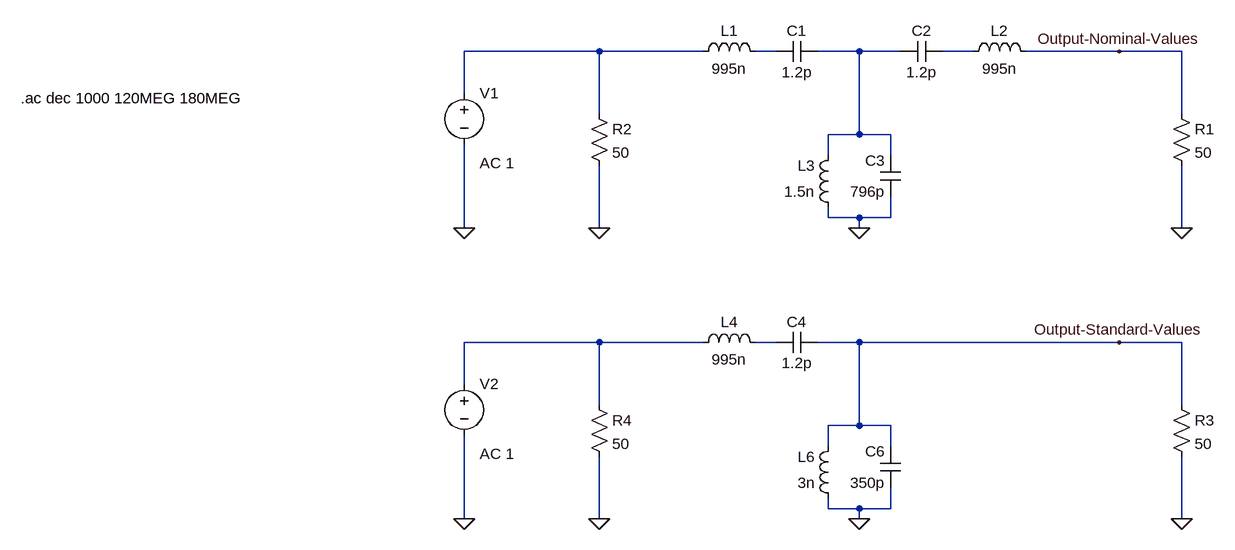
[diagram p0: schematic 2m_lc_bpf_revision_1.asc]
2m_lc_bpf_revision_1.asc, the LTspice schematic file:
Version 4
SHEET 1 880 820
WIRE -176 80 -384 80
WIRE -16 80 -176 80
WIRE 96 80 64 80
WIRE 224 80 160 80
WIRE 288 80 224 80
WIRE 400 80 352 80
WIRE 624 80 480 80
WIRE 720 80 624 80
WIRE -384 144 -384 80
WIRE -176 176 -176 80
WIRE 720 176 720 80
WIRE 224 208 224 80
WIRE 224 208 176 208
WIRE 272 208 224 208
WIRE 176 240 176 208
WIRE 272 240 272 208
WIRE 176 336 176 320
WIRE 224 336 176 336
WIRE 272 336 272 304
WIRE 272 336 224 336
WIRE -384 352 -384 224
WIRE -176 352 -176 256
WIRE 224 352 224 336
WIRE 720 352 720 256
WIRE -176 528 -384 528
WIRE -16 528 -176 528
WIRE 96 528 64 528
WIRE 224 528 160 528
WIRE 624 528 224 528
WIRE 720 528 624 528
WIRE -384 592 -384 528
WIRE -176 624 -176 528
WIRE 720 624 720 528
WIRE 224 656 224 528
WIRE 224 656 176 656
WIRE 272 656 224 656
WIRE 176 688 176 656
WIRE 272 688 272 656
WIRE 176 784 176 768
WIRE 224 784 176 784
WIRE 272 784 272 752
WIRE 272 784 224 784
WIRE -384 800 -384 672
WIRE -176 800 -176 704
WIRE 224 800 224 784
WIRE 720 800 720 704
FLAG 224 352 0
FLAG -384 352 0
FLAG 720 352 0
FLAG -176 352 0
FLAG 624 80 Output-Nominal-Values
FLAG -384 800 0
FLAG 224 800 0
FLAG 720 800 0
FLAG -176 800 0
FLAG 624 528 Output-Standard-Values
SYMBOL ind -32 96 R270
WINDOW 0 32 56 VTop 2
WINDOW 3 5 56 VBottom 2
SYMATTR InstName L1
SYMATTR Value 995n
SYMATTR SpiceLine Rser=10m
SYMBOL ind 384 96 R270
WINDOW 0 32 56 VTop 2
WINDOW 3 5 56 VBottom 2
SYMATTR InstName L2
SYMATTR Value 995n
SYMATTR SpiceLine Rser=10m
SYMBOL ind 192 336 R180
WINDOW 0 36 80 Left 2
WINDOW 3 36 40 Left 2
SYMATTR InstName L3
SYMATTR Value 1.5n
SYMATTR SpiceLine Rser=10m
SYMBOL cap 160 64 R90
WINDOW 0 0 32 VBottom 2
WINDOW 3 32 32 VTop 2
SYMATTR InstName C1
SYMATTR Value 1.2p
SYMATTR SpiceLine Rser=10m
SYMBOL cap 352 64 R90
WINDOW 0 0 32 VBottom 2
WINDOW 3 32 32 VTop 2
SYMATTR InstName C2
SYMATTR Value 1.2p
SYMATTR SpiceLine Rser=10m
SYMBOL cap 288 304 R180
WINDOW 0 24 56 Left 2
WINDOW 3 24 8 Left 2
SYMATTR InstName C3
SYMATTR Value 796p
SYMATTR SpiceLine Rser=10m
SYMBOL voltage -384 128 R0
WINDOW 123 24 124 Left 2
WINDOW 39 24 152 Left 2
SYMATTR InstName V1
SYMATTR Value ""
SYMATTR Value2 AC 1
SYMBOL res 704 160 R0
SYMATTR InstName R1
SYMATTR Value 50
SYMBOL res -192 160 R0
SYMATTR InstName R2
SYMATTR Value 50
SYMBOL voltage -384 576 R0
WINDOW 123 24 124 Left 2
WINDOW 39 24 152 Left 2
SYMATTR InstName V2
SYMATTR Value ""
SYMATTR Value2 AC 1
SYMBOL ind -32 544 R270
WINDOW 0 32 56 VTop 2
WINDOW 3 5 56 VBottom 2
SYMATTR InstName L4
SYMATTR Value 995n
SYMATTR SpiceLine Rser=10m
SYMBOL ind 192 784 R180
WINDOW 0 36 80 Left 2
WINDOW 3 36 40 Left 2
SYMATTR InstName L6
SYMATTR Value 3n
SYMATTR SpiceLine Rser=10m
SYMBOL cap 160 512 R90
WINDOW 0 0 32 VBottom 2
WINDOW 3 32 32 VTop 2
SYMATTR InstName C4
SYMATTR Value 1.2p
SYMATTR SpiceLine Rser=10m
SYMBOL cap 288 752 R180
WINDOW 0 24 56 Left 2
WINDOW 3 24 8 Left 2
SYMATTR InstName C6
SYMATTR Value 350p
SYMATTR SpiceLine Rser=10m
SYMBOL res 704 608 R0
SYMATTR InstName R3
SYMATTR Value 50
SYMBOL res -192 608 R0
SYMATTR InstName R4
SYMATTR Value 50
TEXT -1066 152 Left 2 !.ac dec 1000 120MEG 180MEG

The netlist it stands for:
* 2m_lc_bpf_revision_1.asc
L1 N001 N002 995n Rser=10m
L2 N004 Output-Nominal-Values 995n Rser=10m
L3 0 N003 1.5n Rser=10m
C1 N003 N002 1.2p Rser=10m
C2 N004 N003 1.2p Rser=10m
C3 0 N003 796p Rser=10m
V1 N001 0 AC 1
R1 Output-Nominal-Values 0 50
R2 N001 0 50
V2 N005 0 AC 1
L4 N005 N006 995n Rser=10m
L6 0 Output-Standard-Values 3n Rser=10m
C4 Output-Standard-Values N006 1.2p Rser=10m
C6 0 Output-Standard-Values 350p Rser=10m
R3 Output-Standard-Values 0 50
R4 N005 0 50
.ac dec 1000 120MEG 180MEG
.backanno
.end